# Altium schematic sheet SPI to USB.SchDoc
size A; SheetNumber: 8; SheetTotal: 8
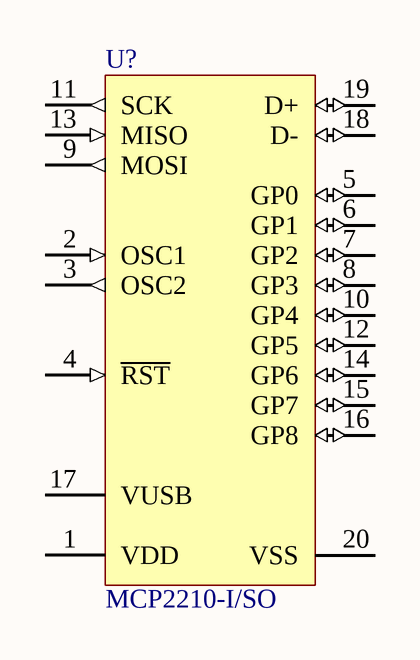
[diagram p0: SPI to USB.SchDoc]

## Parts
U?  MCP2210-I/SO  [SOIC-SO20_N]

## Nets

Not connected (* = marked no-connect by the designer): U? 1(VDD) 2(OSC1) 3(OSC2) 4(~{RST}) 5(GP0) 6(GP1) 7(GP2) 8(GP3) 9(MOSI) 10(GP4) 11(SCK) 12(GP5) 13(MISO) 14(GP6) 15(GP7) 16(GP8) 17(VUSB) 18(D-) 19(D+) 20(VSS)

## Library data of the parts
U? = CMP-0186-00211-1: USB-to-SPI Protocol Converter with GPIO (Master Mode), 20-Pin SOIC, Industrial Temperature; ComponentLink2URL: http://ww1.microchip.com/downloads/en/DeviceDoc/22288A.pdf; Code_JEDEC: MS-013-AC; PackageDescription: 20-Lead Plastic Small Outline (SO) - Wide 7.50mm Body [SOIC]; ComponentLink1Description: Manufacturer URL; ComponentLink3Description: Package Specification; DatasheetVersion: revA, Dec-2011; PackageReference: SOIC-SO20; Code_IPC: SOIC127P1030-20; ComponentLink3URL: http://www.microchip.com/stellent/groups/techpub_sg/documents/packagingspec/en012702.pdf; ComponentLink1URL: http://www.microchip.com/; PackageVersion: revBB, Aug-2009; ComponentLink2Description: Datasheet